# Altium project LimeSDR-PCIe_1v2.PrjPcb (part 5 of 6)

## Sheet 15_Clocks_2.SchDoc: Clocks 2
size A4; Organization: Lime Microsystems; Address1: Surrey Tech Centre; Address2: Guildford GU2 7YG; Address3: Surrey; Address4: United Kingdom; Revision: v1.2; SheetNumber: 15; SheetTotal: 16
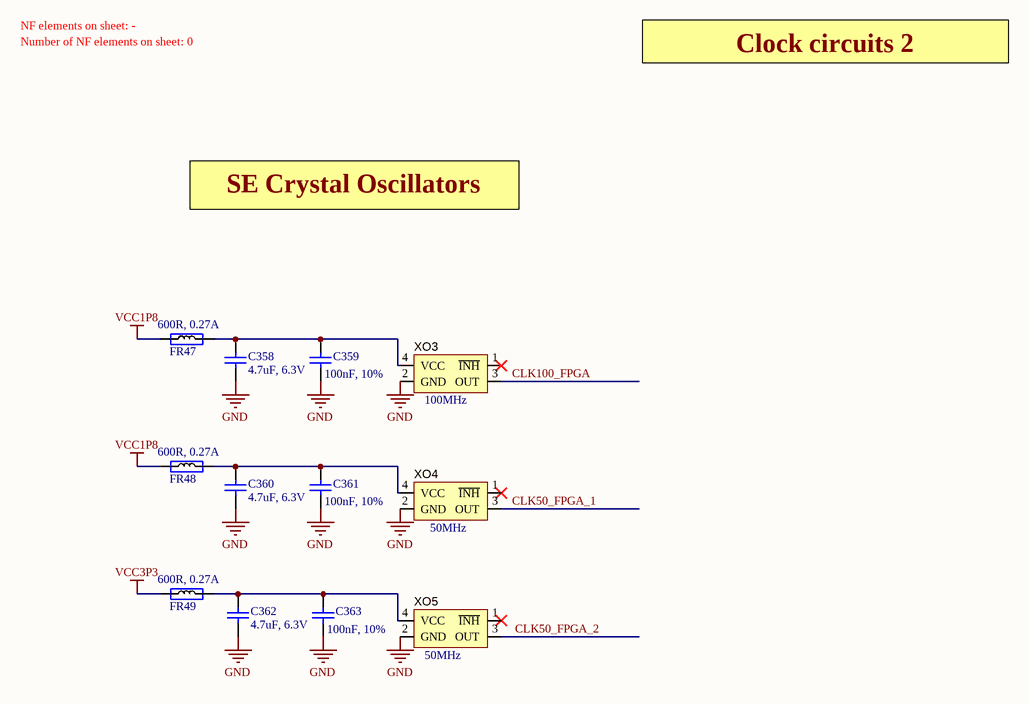
[diagram p15: 15_Clocks_2.SchDoc]

### Parts
C358  4.7uF, 6.3V  [CAP0402]
C359  100nF, 10%  [CAP0402]
C360  4.7uF, 6.3V  [CAP0402]
C361  100nF, 10%  [CAP0402]
C362  4.7uF, 6.3V  [CAP0402]
C363  100nF, 10%  [CAP0402]
FR47  600R, 0.27A  [RES0201]
FR48  600R, 0.27A  [RES0201]
FR49  600R, 0.27A  [RES0201]
XO3  value 100MHz  [CRYSTAL_4-LCC_v4]  (hidden comment: CRYSTAL 100MHz)
XO4  value 50MHz  [CRYSTAL_4-LCC_v4]  (hidden comment: CRYSTAL 50MHz (nr. 1))
XO5  value 50MHz  [CRYSTAL_4-LCC_v4]  (hidden comment: CRYSTAL 50MHz (nr. 2))

### Nets
GND: C358.1 C359.2 C360.1 C361.2 C362.1 C363.2 XO3.2(GND) XO4.2(GND) XO5.2(GND)
VCC1P8: FR47.1 FR48.1
VCC3P3: FR49.1
CLK50_FPGA_1: XO4.3(OUT)
CLK50_FPGA_2: XO5.3(OUT)
CLK100_FPGA: XO3.3(OUT)
NetC358_2: C358.2 C359.1 FR47.2 XO3.4(VCC)
NetC360_2: C360.2 C361.1 FR48.2 XO4.4(VCC)
NetC362_2: C362.2 C363.1 FR49.2 XO5.4(VCC)

Not connected (* = marked no-connect by the designer): XO3 1(~{INH})*; XO4 1(~{INH})*; XO5 1(~{INH})*

### Notes on the sheet
- Number of NF elements on sheet: 0
- NF elements on sheet: -
- Clock circuits 2
- SE Crystal Oscillators
- Project name:
- Title:
- Size:
- Date:
- A4
- Revision:
- Time:
- Sheet
- of
- File:

### Library data of the parts
C358 C360 C362 = Cap_0402: Manufacturer Part Number 1: GRM155R60J475ME87D; Manufacturer: Murata Electronics North America; Part Description: 4.7µF ±20% 6.3V X5R Ceramic Capacitor -55°C ~ 85°C Surface Mount, MLCC 0402 (1005 Metric) 0.039" L x 0.020" W (1.00mm x 0.50mm); Temperature Coefficient: X5R; Capacitance: 4.7µF; Tolerance: ±20%; Value: 4.7uF, 6.3V; Supplier 1: Digi-Key; Supplier Part Number 1: 490-5408-1-ND; Category: Capacitors; Voltage - Rated: 6.3V; Thickness (Max): 0.022" (0.55mm); Applications: General Purpose; Package / Case: 0402 (1005 Metric); Size / Dimension: 0.039" L x 0.020" W (1.00mm x 0.50mm); Features: Derating Recommended; Mounting Type: Surface Mount, MLCC; Ratings: -; Lead Style: -; Operating Temperature: -55°C ~ 85°C; Lead Spacing: -; RoHS: RoHS Compliant; Height - Seated (Max): -; Packaging: Cut Tape (CT)
C359 C361 C363 = Cap_0603: Manufacturer Part Number 1: GRM155R71C104KA88D; Part Description: 0.10µF ±10% 16V X7R Ceramic Capacitor -55°C ~ 125°C Surface Mount, MLCC 0402 (1005 Metric) 0.039" L x 0.020" W (1.00mm x 0.50mm); Brand: Murata Electronics; Type: General Purpose MLCC; Capacitance: 0.1 uF; Temperature Coefficient / Code: +/- 15 %; Voltage Rating DC: 16 V; Supplier 1: Mouser; Supplier Part Number 1: 81-GRM155R71C104KA88; Tolerance: 10 %; Case Code - in: 0402; Manufacturer: Murata Electronics; Category: Multilayer Ceramic Capacitors MLCC - SMD/SMT; Value: 100nF, 10%; Manufacturer Part Number: GRM155R71C104KA88D; Maximum Operating Temperature: + 125 C; Minimum Operating Temperature: - 55 C; Minimum Order Quantity: 1; Operating Temperature Range: - 55 C to + 125 C; Package / Case: 0402 (1005 metric); Packaging: Reel; Product: General Type MLCCs; Product Category: Low & Medium Capacitance SMD Ceramic Chip Capacitors; Reeling: True; RoHS - Mouser: Y; RoHS: RoHS Compliant; Series: GRM; Standard Pack Qty: 10000; Termination Style: SMD/SMT
FR47-FR49 = Ferrite: Manufacturer Part Number 1: BK0603TS601-T; Manufacturer: Taiyo Yuden; Part Description: FERRITE BEAD 600 OHM 0201 1LN; DC Resistance (DCR): 750 mOhm Max; Filter Type: Differential Mode - Single; Impedance @ Frequency: 600 Ohm @ 100MHz; Current Rating: 270mA; Supplier 1: Digi-Key; Supplier Part Number 1: 587-3277-1-ND; Size / Dimension: 0.024" L x 0.012" W (0.60mm x 0.30mm); Package / Case: 0201 (0603 Metric); Height (Max): 0.013" (0.33mm); Mounting Type: Surface Mount; Packaging: Cut Tape (CT); RoHS: RoHS Compliant; Category: Filters; Value: 600R, 0.27A
XO3 = CRYSTAL: Oscillator Crystal; Manufacturer Part Number: KC5032A100.000C1GE00; Manufacturer: AVX Corp/Kyocera Corp; Part Description: OSC XO 100.000MHZ CMOS SMD; Current - Supply (Max): 19mA; Current - Supply (Disable) (Max): 10µA; Voltage - Supply: 1.8V, 2.5V, 3.3V; Function: Standby (Power Down); Output: CMOS; Frequency Stability: ±50ppm; Package / Case: 4-SMD, No Lead (DFN, LCC); Mounting Type: Surface Mount; Ratings: -; RoHS: RoHS Compliant; Height: 0.039" (1.00mm); Category: Crystals and Oscillators; Supplier Part Number 1: 1253-1302-1-ND; Supplier 1: Digi-Key; Size / Dimension: 0.197" L x 0.126" W (5.00mm x 3.20mm); Packaging: Cut Tape (CT); Frequency: 100MHz; Operating Temperature: -40°C ~ 85°C; Type: XO (Standard)
XO4 XO5 = CRYSTAL: Oscillator Crystal; Manufacturer Part Number: KC5032A50.0000CMGE00; Manufacturer: AVX Corp/Kyocera Corp; Part Description: OSCILLATOR XO 50.000MHZ CMOS SMD; Current - Supply (Disable) (Max): 10µA; Frequency Stability: ±50ppm; Voltage - Supply: 1.8V, 2.5V, 3.3V, 5V; Output: CMOS; Current - Supply (Max): 9.5mA; Function: Standby (Power Down); Package / Case: 4-SMD, No Lead (DFN, LCC); Height: 0.039" (1.00mm); Supplier Part Number 1: 1253-1297-1-ND; Supplier 1: Digi-Key; Packaging: Cut Tape (CT); Category: Crystals and Oscillators; Mounting Type: Surface Mount; RoHS: RoHS Compliant; Frequency: 50MHz; Ratings: -; Type: XO (Standard); Size / Dimension: 0.197" L x 0.126" W (5.00mm x 3.20mm); Operating Temperature: -40°C ~ 85°C

## Sheet 16_BoardPowerSupply.SchDoc: Board power supply
size A3; Organization: Lime Microsystems; Address1: Surrey Tech Centre; Address2: Guildford GU2 7YG; Address3: Surrey; Address4: United Kingdom; Revision: v1.2; SheetNumber: 16; SheetTotal: 16
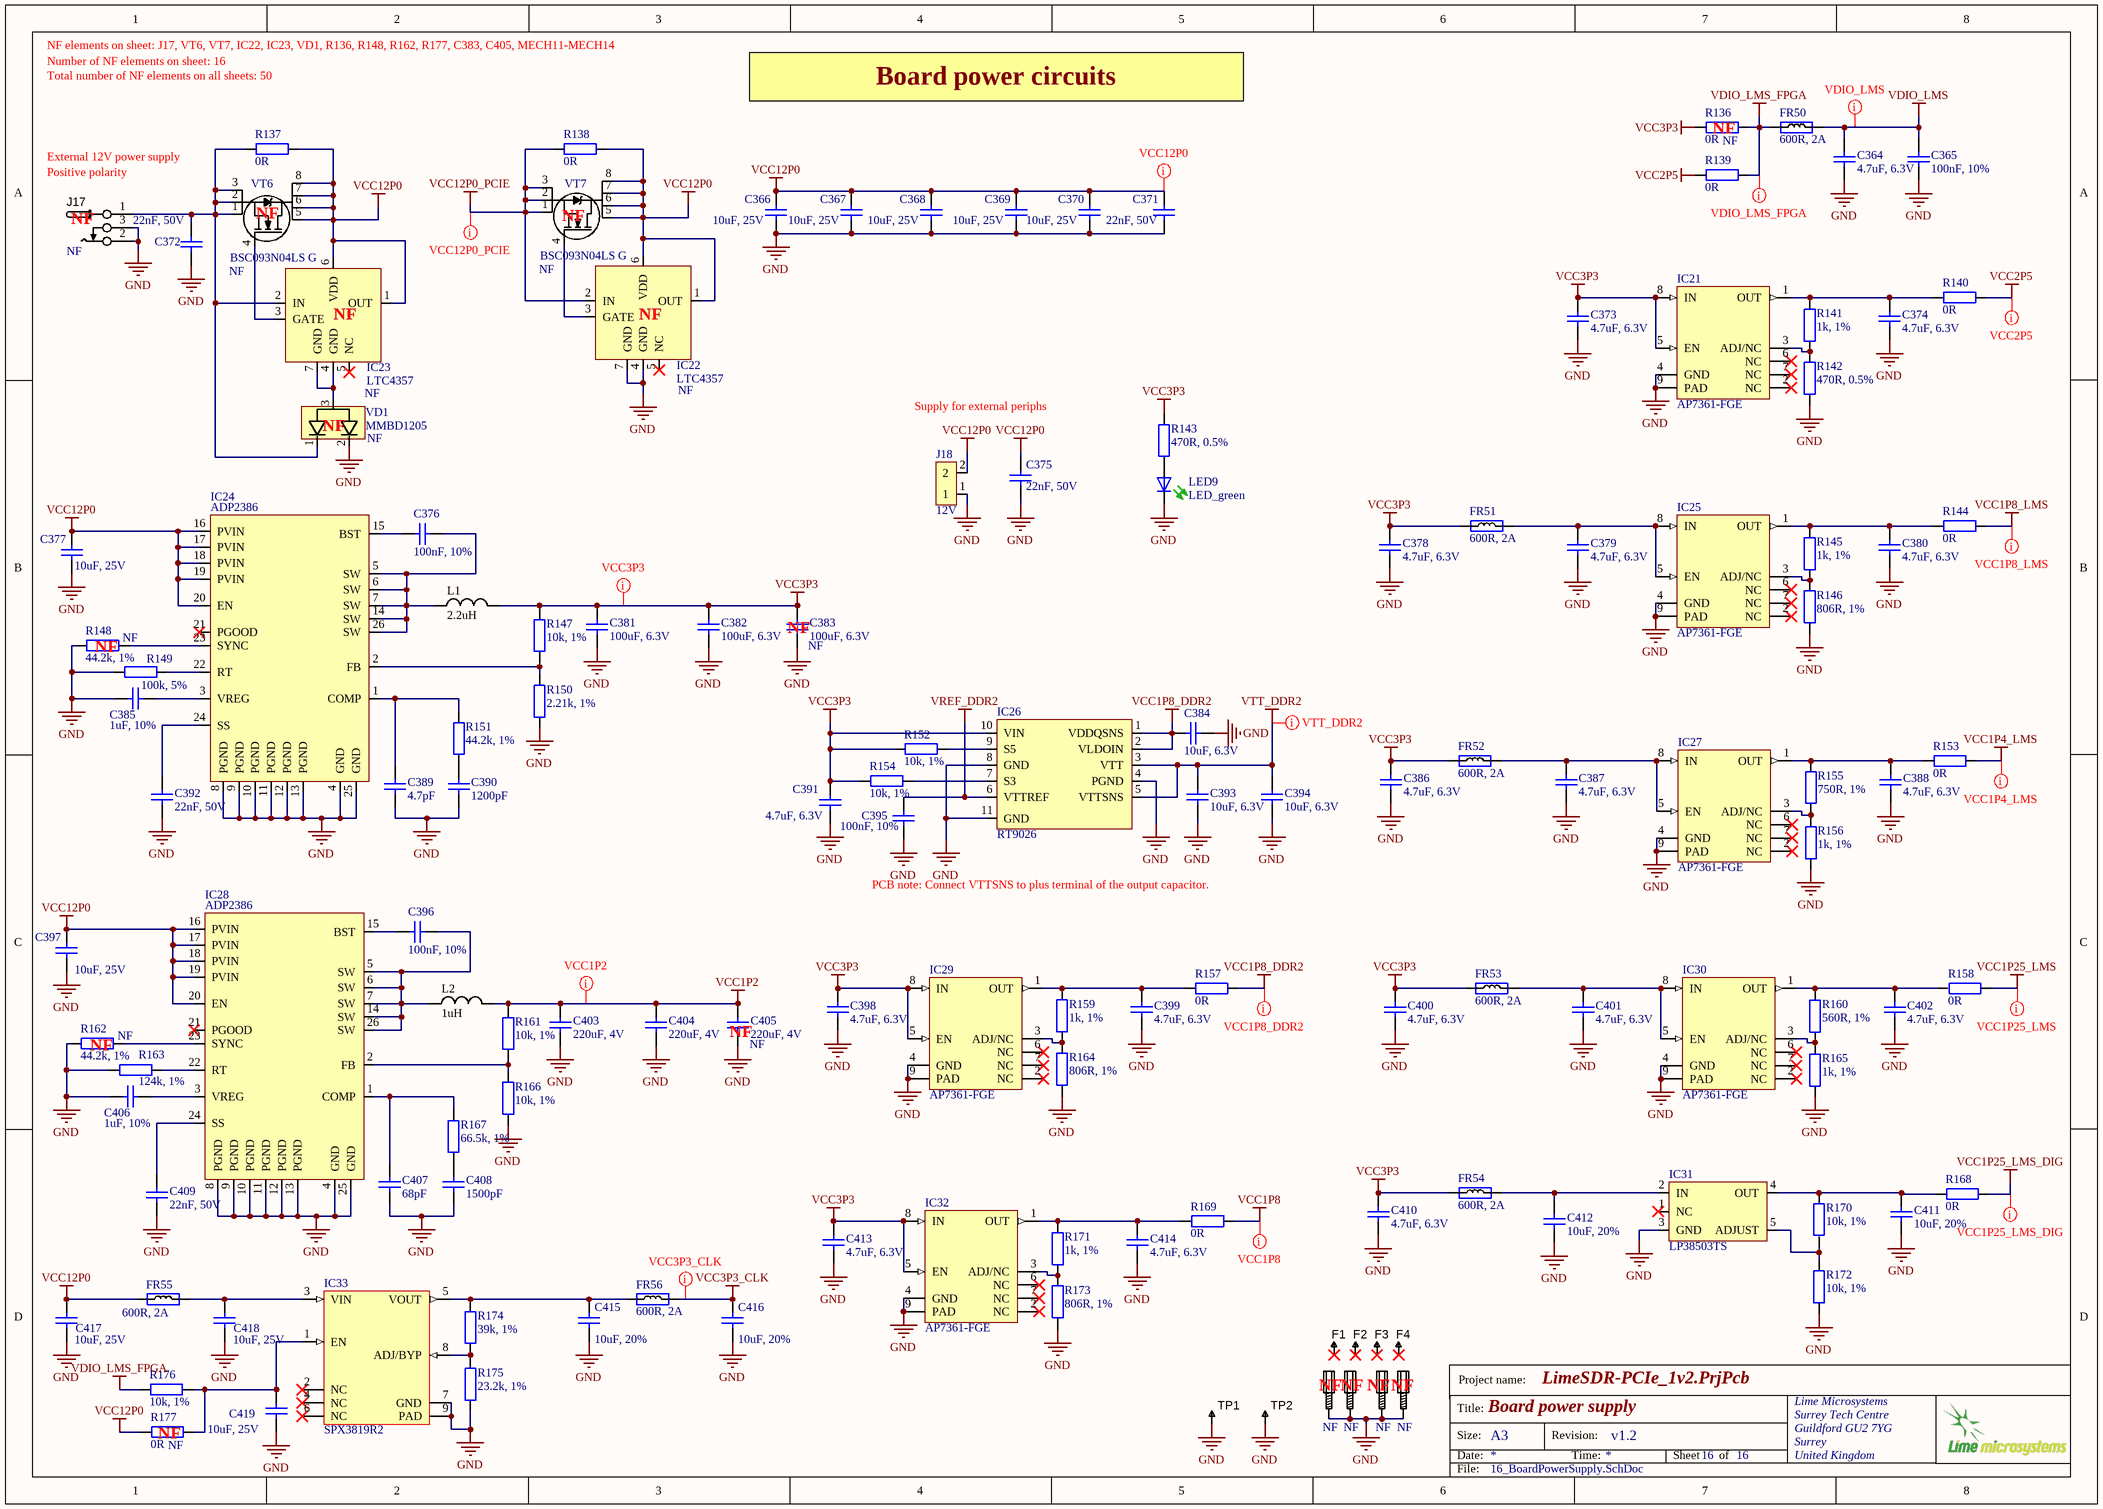
[diagram p16: 16_BoardPowerSupply.SchDoc]

### Parts
C364  4.7uF, 6.3V  [CAP0402]
C365  100nF, 10%  [CAP0402]
C366  10uF, 25V  [CAP0603]
C367  10uF, 25V  [CAP0603]
C368  10uF, 25V  [CAP0603]
C369  10uF, 25V  [CAP0603]
C370  10uF, 25V  [CAP0603]
C371  22nF, 50V  [CAP0402]
C372  22nF, 50V  [CAP0402]
C373  4.7uF, 6.3V  [CAP0402]
C374  4.7uF, 6.3V  [CAP0402]
C375  22nF, 50V  [CAP0402]
C376  100nF, 10%  [CAP0402]
C377  10uF, 25V  [CAP0603]
C378  4.7uF, 6.3V  [CAP0402]
C379  4.7uF, 6.3V  [CAP0402]
C380  4.7uF, 6.3V  [CAP0402]
C381  100uF, 6.3V  [CAP1206]
C382  100uF, 6.3V  [CAP1206]
C383  100uF, 6.3V  Assembly Info: NF  [CAP1206]
C384  10uF, 6.3V  [CAP0603]
C385  1uF, 10%  [CAP0402]
C386  4.7uF, 6.3V  [CAP0402]
C387  4.7uF, 6.3V  [CAP0402]
C388  4.7uF, 6.3V  [CAP0402]
C389  4.7pF  [CAP0402]
C390  1200pF  [CAP0402]
C391  4.7uF, 6.3V  [CAP0402]
C392  22nF, 50V  [CAP0402]
C393  10uF, 6.3V  [CAP0603]
C394  10uF, 6.3V  [CAP0603]
C395  100nF, 10%  [CAP0402]
C396  100nF, 10%  [CAP0402]
C397  10uF, 25V  [CAP0603]
C398  4.7uF, 6.3V  [CAP0402]
C399  4.7uF, 6.3V  [CAP0402]
C400  4.7uF, 6.3V  [CAP0402]
C401  4.7uF, 6.3V  [CAP0402]
C402  4.7uF, 6.3V  [CAP0402]
C403  220uF, 4V  [CAP1206]
C404  220uF, 4V  [CAP1206]
C405  220uF, 4V  Assembly Info: NF  [CAP1206]
C406  1uF, 10%  [CAP0402]
C407  68pF  [CAP0402]
C408  1500pF  [CAP0402]
C409  22nF, 50V  [CAP0402]
C410  4.7uF, 6.3V  [CAP0402]
C411  10uF, 20%  [CAP0603]
C412  10uF, 20%  [CAP0603]
C413  4.7uF, 6.3V  [CAP0402]
C414  4.7uF, 6.3V  [CAP0402]
C415  10uF, 20%  [CAP0603]
C416  10uF, 20%  [CAP0603]
C417  10uF, 25V  [CAP0603]
C418  10uF, 25V  [CAP0603]
C419  10uF, 25V  [CAP0603]
F1  Fiducial  [Fiducial]  (value not drawn)
F2  Fiducial  [Fiducial]  (value not drawn)
F3  Fiducial  [Fiducial]  (value not drawn)
F4  Fiducial  [Fiducial]  (value not drawn)
FR50  600R, 2A  [RES0805]
FR51  600R, 2A  [RES0805]
FR52  600R, 2A  [RES0805]
FR53  600R, 2A  [RES0805]
FR54  600R, 2A  [RES0805]
FR55  600R, 2A  [RES0805]
FR56  600R, 2A  [RES0805]
IC21  AP7361-FGE  [AP7361]
IC22  LTC4357  Assembly Info: NF  [LTC4357]
IC23  LTC4357  Assembly Info: NF  [LTC4357]
IC24  ADP2386  [ADP2386]
IC25  AP7361-FGE  [AP7361]
IC26  RT9026  [MSOP10]
IC27  AP7361-FGE  [AP7361]
IC28  ADP2386  [ADP2386]
IC29  AP7361-FGE  [AP7361]
IC30  AP7361-FGE  [AP7361]
IC31  LP38503TS  [TO-263-5_v2]
IC32  AP7361-FGE  [AP7361]
IC33  SPX3819R2  [SPX3819R2-L/TR]
J17  Assembly Info: NF  [CONN_PWR_JACK_v2]  (hidden comment: CONN_PWR_JACK_2.1x5.5mm)
J18  12V  [HDR_1x2]
L1  2.2uH  [FDVE1040_TOKO_INDUCTOR]
L2  1uH  [FDVE1040_TOKO_INDUCTOR]
LED9  LED_green  [LED-0603-GREEN]
MECH11  Assembly Info: NF  [PCB_standoff]  (hidden comment: # pcs.)
MECH12  Assembly Info: NF  [PCB_standoff]  (hidden comment: # pcs.)
MECH13  Assembly Info: NF  [PCB_standoff]  (hidden comment: # pcs.)
MECH14  Assembly Info: NF  [PCB_standoff]  (hidden comment: # pcs.)
R136  0R  Assembly Info: NF  [RES0402]
R137  0R  [RES0805]
R138  0R  [RES0805]
R139  0R  [RES0402]
R140  0R  [RES0402]
R141  1k, 1%  [RES0402]
R142  470R, 0.5%  [RES0402]
R143  470R, 0.5%  [RES0402]
R144  0R  [RES0402]
R145  1k, 1%  [RES0402]
R146  806R, 1%  [RES0402]
R147  10k, 1%  [RES0402]
R148  44.2k, 1%  Assembly Info: NF  [RES0402]
R149  100k, 5%  [RES0402]
R150  2.21k, 1%  [RES0402]
R151  44.2k, 1%  [RES0402]
R152  10k, 1%  [RES0402]
R153  0R  [RES0402]
R154  10k, 1%  [RES0402]
R155  750R, 1%  [RES0402]
R156  1k, 1%  [RES0402]
R157  0R  [RES0402]
R158  0R  [RES0402]
R159  1k, 1%  [RES0402]
R160  560R, 1%  [RES0402]
R161  10k, 1%  [RES0402]
R162  44.2k, 1%  Assembly Info: NF  [RES0402]
R163  124k, 1%  [RES0402]
R164  806R, 1%  [RES0402]
R165  1k, 1%  [RES0402]
R166  10k, 1%  [RES0402]
R167  66.5k, 1%  [RES0402]
R168  0R  [RES0402]
R169  0R  [RES0402]
R170  10k, 1%  [RES0402]
R171  1k, 1%  [RES0402]
R172  10k, 1%  [RES0402]
R173  806R, 1%  [RES0402]
R174  39k, 1%  [RES0402]
R175  23.2k, 1%  [RES0402]
R176  10k, 1%  [RES0402]
R177  0R  Assembly Info: NF  [RES0402]
TP1  TESTPOINT_THT_MINI  [TP-THT-MIDI]  (value not drawn)
TP2  TESTPOINT_THT_MINI  [TP-THT-MIDI]  (value not drawn)
VD1  MMBD1205  Assembly Info: NF  [SOT23-3_v2]
VT6  BSC093N04LS G  Assembly Info: NF  [BSC093N04LS_G]
VT7  BSC093N04LS G  Assembly Info: NF  [BSC093N04LS_G]

### Nets
GND: C364.1 C365.2 C366.1 C367.1 C368.1 C369.1 C370.1 C371.2 C372.2 C373.1 C374.1 C375.2 C377.1 C378.1 C379.1 C380.1 C381.1 C382.1 C383.1 C384.1 C385.2 C386.1 C387.1 C388.1 C389.2 C390.2 C391.1 C392.2 C393.1 C394.1 C395.2 C397.1 C398.1 C399.1 C400.1 C401.1 C402.1 C403.1 C404.1 C405.1 C406.2 C407.2 C408.2 C409.2 C410.1 C411.1 C412.1 C413.1 C414.1 C415.1 C416.1 C417.1 C418.1 C419.1 IC21.4(GND) IC21.9(PAD) IC22.4(GND) IC22.7(GND) IC24.4(GND) IC24.8(PGND) IC24.9(PGND) IC24.10(PGND) IC24.11(PGND) IC24.12(PGND) IC24.13(PGND) IC24.25(GND) IC25.4(GND) IC25.9(PAD) IC26.4(PGND) IC26.8(GND) IC26.11(GND) IC27.4(GND) IC27.9(PAD) IC28.4(GND) IC28.8(PGND) IC28.9(PGND) IC28.10(PGND) IC28.11(PGND) IC28.12(PGND) IC28.13(PGND) IC28.25(GND) IC29.4(GND) IC29.9(PAD) IC30.4(GND) IC30.9(PAD) IC31.3(GND) IC32.4(GND) IC32.9(PAD) IC33.7(GND) IC33.9(PAD) J17.2 J17.3 J18.1 LED9.K(C) MECH11.MH1 MECH12.MH1 MECH13.MH1 MECH14.MH1 R142.2 R146.2 R148.1 R149.2 R150.1 R156.1 R162.1 R163.2 R164.2 R165.1 R166.2 R172.2 R173.2 R175.1 TP1.1 TP2.1 VD1.2
VCC1P2: C403.2 C404.2 C405.2 L2.2 R161.1
VCC1P4_LMS: R153.1
VCC1P8: R169.1
VCC1P8_DDR2: C384.2 IC26.1(VDDQSNS) IC26.2(VLDOIN) R157.1
VCC1P8_LMS: R144.1
VCC1P25_LMS: R158.1
VCC1P25_LMS_DIG: R168.1
VCC2P5: R139.2 R140.1
VCC3P3: C373.2 C378.2 C381.2 C382.2 C383.2 C386.2 C391.2 C398.2 C400.2 C410.2 C413.2 FR51.1 FR52.1 FR53.1 FR54.1 IC21.5(EN) IC21.8(IN) IC26.10(VIN) IC29.5(EN) IC29.8(IN) IC32.5(EN) IC32.8(IN) L1.2 R136.2 R143.2 R147.1 R152.1 R154.1
VCC3P3_CLK: C416.2 FR56.2
VCC12P0: C366.2 C367.2 C368.2 C369.2 C370.2 C371.1 C375.1 C377.2 C397.2 C417.2 FR55.1 IC22.1(OUT) IC22.6(VDD) IC23.1(OUT) IC23.6(VDD) IC24.16(PVIN) IC24.17(PVIN) IC24.18(PVIN) IC24.19(PVIN) IC24.20(EN) IC28.16(PVIN) IC28.17(PVIN) IC28.18(PVIN) IC28.19(PVIN) IC28.20(EN) J18.2 R137.1 R138.1 R177.2 VT6.5(D) VT6.6(D) VT6.7(D) VT6.8(D) VT7.5(D) VT7.6(D) VT7.7(D) VT7.8(D)
VCC12P0_PCIE: IC22.2(IN) R138.2 VT7.1(S) VT7.2(S) VT7.3(S)
VDIO_LMS: C364.2 C365.1 FR50.2
VDIO_LMS_FPGA: FR50.1 R136.1 R139.1 R176.1
VREF_DDR2: C395.1 IC26.6(VTTREF)
VTT_DDR2: C393.2 C394.2 IC26.3(VTT) IC26.5(VTTSNS)
NetC372_1: C372.1 IC23.2(IN) J17.1 R137.2 VD1.1 VT6.1(S) VT6.2(S) VT6.3(S)
NetC374_2: C374.2 IC21.1(OUT) R140.2 R141.2
NetC376_1: C376.1 IC24.15(BST)
NetC376_2: C376.2 IC24.5(SW) IC24.6(SW) IC24.7(SW) IC24.14(SW) IC24.26(SW) L1.1
NetC379_2: C379.2 FR51.2 IC25.5(EN) IC25.8(IN)
NetC380_2: C380.2 IC25.1(OUT) R144.2 R145.2
NetC385_1: C385.1 IC24.3(VREG)
NetC387_2: C387.2 FR52.2 IC27.5(EN) IC27.8(IN)
NetC388_2: C388.2 IC27.1(OUT) R153.2 R155.1
NetC389_1: C389.1 IC24.1(COMP) R151.2
NetC390_1: C390.1 R151.1
NetC392_1: C392.1 IC24.24(SS)
NetC396_1: C396.1 IC28.15(BST)
NetC396_2: C396.2 IC28.5(SW) IC28.6(SW) IC28.7(SW) IC28.14(SW) IC28.26(SW) L2.1
NetC399_2: C399.2 IC29.1(OUT) R157.2 R159.2
NetC401_2: C401.2 FR53.2 IC30.5(EN) IC30.8(IN)
NetC402_2: C402.2 IC30.1(OUT) R158.2 R160.2
NetC406_1: C406.1 IC28.3(VREG)
NetC407_1: C407.1 IC28.1(COMP) R167.2
NetC408_1: C408.1 R167.1
NetC409_1: C409.1 IC28.24(SS)
NetC411_2: C411.2 IC31.4(OUT) R168.2 R170.1
NetC412_2: C412.2 FR54.2 IC31.2(IN)
NetC414_2: C414.2 IC32.1(OUT) R169.2 R171.2
NetC415_2: C415.2 FR56.1 IC33.5(VOUT) R174.1
NetC418_2: C418.2 FR55.2 IC33.3(VIN)
NetC419_2: C419.2 IC33.1(EN) R176.2 R177.1
NetIC21_3: IC21.3(ADJ/NC) R141.1 R142.1
NetIC22_3: IC22.3(GATE) VT7.4(G)
NetIC23_3: IC23.3(GATE) VT6.4(G)
NetIC23_4: IC23.4(GND) IC23.7(GND) VD1.3
NetIC24_2: IC24.2(FB) R147.2 R150.2
NetIC24_22: IC24.22(RT) R149.1
NetIC24_23: IC24.23(SYNC) R148.2
NetIC25_3: IC25.3(ADJ/NC) R145.1 R146.1
NetIC26_7: IC26.7(S3) R154.2
NetIC26_9: IC26.9(S5) R152.2
NetIC27_3: IC27.3(ADJ/NC) R155.2 R156.2
NetIC28_2: IC28.2(FB) R161.2 R166.1
NetIC28_22: IC28.22(RT) R163.1
NetIC28_23: IC28.23(SYNC) R162.2
NetIC29_3: IC29.3(ADJ/NC) R159.1 R164.1
NetIC30_3: IC30.3(ADJ/NC) R160.1 R165.2
NetIC31_5: IC31.5(ADJUST) R170.2 R172.1
NetIC32_3: IC32.3(ADJ/NC) R171.1 R173.1
NetIC33_8: IC33.8(ADJ/BYP) R174.2 R175.2
NetLED9_A: LED9.A R143.1

Not connected (* = marked no-connect by the designer): F1 1*; F2 1*; F3 1*; F4 1*; IC21 2(NC)* 6(NC)* 7(NC)*; IC22 5(NC)*; IC23 5(NC)*; IC24 21(PGOOD)*; IC25 2(NC)* 6(NC)* 7(NC)*; IC27 2(NC)* 6(NC)* 7(NC)*; IC28 21(PGOOD)*; IC29 2(NC)* 6(NC)* 7(NC)*; IC30 2(NC)* 6(NC)* 7(NC)*; IC31 1(NC)*; IC32 2(NC)* 6(NC)* 7(NC)*; IC33 2(NC)* 4(NC)* 6(NC)*

### Layout directives
net class VDIO_LMS: VDIO_LMS
net class VDIO_LMS_FPGA: VDIO_LMS_FPGA
net class VCC2P5: VCC2P5
net class VCC1P8_LMS: VCC1P8_LMS
net class VCC1P4_LMS: VCC1P4_LMS
net class VCC1P25_LMS: VCC1P25_LMS
net class VCC1P25_LMS_DIG: VCC1P25_LMS_DIG
net class VCC1P8_DDR2: VCC1P8_DDR2
net class VCC1P8: VCC1P8
net class VCC1P2: VCC1P2
net class VCC3P3: VCC3P3
net class VTT_DDR2: VTT_DDR2
net class VCC12P0: VCC12P0
net class VCC12P0_PCIE: VCC12P0_PCIE
net class VCC3P3_CLK: VCC3P3_CLK

### Notes on the sheet
- Number of NF elements on sheet: 16
- Total number of NF elements on all sheets: 50
- NF elements on sheet: J17, VT6, VT7, IC22, IC23, VD1, R136, R148, R162, R177, C383, C405, MECH11-MECH14
- Board power circuits
- (near J17) Positive polarity
- External 12V power supply
- (near R136) NF
- (near J17) NF
- (near VT6) NF
- (near VT7) NF
- (near IC23) NF
- (near IC22) NF
- (near VD1) NF
- Supply for external periphs
- (near R148) NF
- (near C383) NF
- PCB note: Connect VTTSNS to plus terminal of the output capacitor.
- (near R162) NF
- (near C405) NF
- NF
- (near R177) NF
- Project name:
- Title:
- Size:
- Date:
- A3
- Revision:
- Time:
- Sheet
- of
- File:

### Library data of the parts
C364 C373 C374 C378-C380 C386-C388 C391 C398-C402 C410 C413 C414 = Cap_0402: as C358 on sheet 15_Clocks_2; Value: 4.7uF, 6.3V; Supplier 1: Digi-Key; Supplier Part Number 1: 490-5408-1-ND; Category: Capacitors; Voltage - Rated: 6.3V; Thickness (Max): 0.022" (0.55mm); Applications: General Purpose; Package / Case: 0402 (1005 Metric); Size / Dimension: 0.039" L x 0.020" W (1.00mm x 0.50mm); Features: Derating Recommended; Mounting Type: Surface Mount, MLCC; Ratings: -; Lead Style: -; Operating Temperature: -55°C ~ 85°C; Lead Spacing: -; RoHS: RoHS Compliant; Height - Seated (Max): -; Packaging: Cut Tape (CT)
C365 C395 = Cap_0402: as C312-C314 on sheet 14_Clocks_1; Value: 100nF, 10%; Supplier 1: Mouser; Supplier Part Number 1: 81-GRM155R71C104KA88; Case Code - in: 0402; RoHS: RoHS Compliant; Operating Temperature Range: - 55 C to + 125 C; Series: GRM; Termination Style: SMD/SMT; Tolerance: 10 %; Package / Case: 0402 (1005 metric); Maximum Operating Temperature: + 125 C; Case Code - mm: 1005; Minimum Operating Temperature: - 55 C; Product Category: Low & Medium Capacitance SMD Ceramic Chip Capacitors; Packaging: Reel; Product: General Type MLCCs; Category: Multilayer Ceramic Capacitors MLCC - SMD/SMT; Brand: Murata Electronics; Case Width: 0.5 mm; RoHS - Mouser: Y; Standard Pack Qty: 10000; Minimum Order Quantity: 1; Reeling: True; Manufacturer Part Number 1: GRM155R71C104KA88D
C366-C370 C377 C397 C417-C419 = Cap_0603: Manufacturer: Murata Electronics North America; Manufacturer Part Number: GRM188R61E106MA73D; Part Description: 10µF ±20% 25V X5R Ceramic Capacitor -55°C ~ 85°C Surface Mount, MLCC 0603 (1608 Metric) 0.063" L x 0.031" W (1.60mm x 0.80mm); Capacitance: 10µF; Tolerance: ±20%; Temperature Coefficient: X5R; Supplier 1: Digi-Key; Supplier Part Number 1: 490-7202-2-ND; Category: Capacitors; RoHS: RoHS Compliant; Packaging: Tape & Reel (TR); Voltage - Rated: 25V; Mounting Type: Surface Mount, MLCC; Operating Temperature: -55°C ~ 85°C; Applications: General Purpose; Ratings: -; Package / Case: 0603 (1608 Metric); Size / Dimension: 0.063" L x 0.031" W (1.60mm x 0.80mm); Height - Seated (Max): -; Thickness (Max): 0.031" (0.80mm); Lead Spacing: -; Features: -; Lead Style: -; value: 10uF, 25V
C371 C372 C375 C392 C409 = Cap_0402: Manufacturer: Kemet; Manufacturer Part Number 1: C0402C223K5RACTU; Part Description: 0.022µF ±10% 50V X7R Ceramic Capacitor -55°C ~ 125°C Surface Mount, MLCC 0402 (1005 Metric) 0.039" L x 0.020" W (1.00mm x 0.50mm); Temperature Coefficient: X7R; Tolerance: ±10%; Capacitance: 0.022µF; Value: 22nF, 50V; Supplier 1: Digi-Key; Supplier Part Number 1: 399-7780-1-ND; Ratings: -; Packaging: Cut Tape (CT); Category: Capacitors; Size / Dimension: 0.039" L x 0.020" W (1.00mm x 0.50mm); RoHS: RoHS Compliant; Operating Temperature: -55°C ~ 125°C; Mounting Type: Surface Mount, MLCC; Applications: General Purpose; Voltage - Rated: 50V; Thickness (Max): 0.022" (0.55mm); Features: -; Height - Seated (Max): -; Lead Style: -; Package / Case: 0402 (1005 Metric); Lead Spacing: -
C376 C396 = Cap_0402: Manufacturer: Murata Electronics; Manufacturer Part Number 1: GRM155R71C104KA88D; Part Description: 0.10µF ±10% 16V X7R Ceramic Capacitor -55°C ~ 125°C Surface Mount, MLCC 0402 (1005 Metric) 0.039" L x 0.020" W (1.00mm x 0.50mm); Voltage Rating DC: 16 V; Type: General Purpose MLCC; Capacitance: 0.1 uF; Case Length: 1 mm; Dielectric: X7R; Case Height: 0.5 mm; Temperature Coefficient / Code: +/- 15 %; Value: 100nF, 10%; Supplier 1: Mouser; Supplier Part Number 1: 81-GRM155R71C104KA88; Case Code - in: 0402; RoHS: RoHS Compliant; Operating Temperature Range: - 55 C to + 125 C; Series: GRM; Termination Style: SMD/SMT; Tolerance: 10 %; Package / Case: 0402 (1005 metric); Maximum Operating Temperature: + 125 C; Case Code - mm: 1005; Minimum Operating Temperature: - 55 C; Product Category: Low & Medium Capacitance SMD Ceramic Chip Capacitors; Packaging: Reel; Product: General Type MLCCs; Category: Multilayer Ceramic Capacitors MLCC - SMD/SMT; Brand: Murata Electronics; Case Width: 0.5 mm; RoHS - Mouser: Y; Standard Pack Qty: 10000; Minimum Order Quantity: 1; Reeling: True; Manufacturer Part Number: GRM155R71C104KA88D
C381-C383 = Cap_1206: Manufacturer: MURATA; Manufacturer Part Number 1: GRM31CR60J107ME39L.; Part Description: SMD Multilayer Ceramic Capacitor, GRM Series, 100 µF, ± 20%, X5R, 6.3 V, 1206 [3216 Metric]; Capacitance Tolerance: ± 20%; Ceramic Capacitor Case: 1206 [3216 Metric]; Voltage Rating: 6.3; value: 100uF, 6.3V; Supplier Part Number 1: 1735535; Supplier 1: Farnell
C384 C393 C394 = Cap_0603: Manufacturer Part Number 1: CC0603MRX5R5BB106; Part Description: 10µF ±20% 6.3V X5R Ceramic Capacitor -55°C ~ 85°C Surface Mount, MLCC 0603 (1608 Metric) 0.063" L x 0.031" W (1.60mm x 0.80mm); Manufacturer: Yageo; Capacitance: 10µF; Tolerance: ±20%; Supplier 1: Digi-Key; Supplier Part Number 1: 311-1448-2-ND; Package / Case: 0603 (1608 Metric); Category: Capacitors; Voltage - Rated: 6.3V; Value: 10uF, 6.3V
C385 C406 = Cap_0402: Manufacturer Part Number 1: GRM155R61A105KE15J; Manufacturer: TDK; Part Description: 1µF ±10% 10V X5R Ceramic Capacitor -55°C ~ 85°C Surface Mount, MLCC 0402 (1005 Metric) 0.039" L x 0.020" W (1.00mm x 0.50mm); Voltage Rating: 10; Product Range: TDK - C Series; Ceramic Capacitor Case: 0402 [1005 Metric]; Capacitance: 1; Dielectric Characteristic: X6; Value: 1uF, 10%; Supplier 1: Newark; Supplier Part Number 1: 490-6298-2-ND; Capacitance Tolerance: ± 10%; MSL: -; RoHS: YES
C389 = Cap_0402: Manufacturer: MURATA; Manufacturer Part Number 1: GRM1555C1H4R7CA01D; Part Description: 4.7pF ±0.25pF 50V C0G, NP0 Ceramic Capacitor -55°C ~ 125°C Surface Mount, MLCC 0402 (1005 Metric) 0.039" L x 0.020" W (1.00mm x 0.50mm); Capacitance Tolerance: ± 0.25; Voltage Rating: 50; Dielectric Characteristic: C0G / NP0; Ceramic Capacitor Case: 0402 [1005 Metric]; Capacitance: 4.7; SVHC: No SVHC (15-Jun-2015; Product Range: GRM Series; Value: 4.7pF; Supplier 1: Farnell; Supplier Part Number 1: 2434644; Operating Temperature Max: 125; Operating Temperature Min: -55; MSL: MSL 1 - Unlimited; RoHS: YES; Packaging: Cut Tape
C390 = Cap_0402: Manufacturer: Kemet; Manufacturer Part Number 1: C0402C122J5GACTU; Part Description: 1200pF ±5% 50V C0G, NP0 Ceramic Capacitor -55°C ~ 125°C Surface Mount, MLCC 0402 (1005 Metric) 0.039" L x 0.020" W (1.00mm x 0.50mm); Temperature Coefficient: C0G, NP0; Tolerance: ±5%; Voltage - Rated: 50V; Value: 1200pF; Supplier 1: Digi-Key; Supplier Part Number 1: 399-7334-1-ND; Thickness (Max): 0.022" (0.55mm); Capacitance: 1200pF; Lead Spacing: -; Mounting Type: Surface Mount, MLCC; Package / Case: 0402 (1005 Metric); Category: Capacitors; Size / Dimension: 0.039" L x 0.020" W (1.00mm x 0.50mm); Lead Style: -; Ratings: -; Features: -; Packaging: Cut Tape (CT); RoHS: RoHS Compliant; Operating Temperature: -55°C ~ 125°C; Applications: General Purpose; Height - Seated (Max): -
C403-C405 = Cap_1206: Manufacturer Part Number: GRM31CR60G227ME11L; Manufacturer: Murata Electronics North America; Part Description: 220µF ±20% 4V X5R Ceramic Capacitor -55°C ~ 85°C Surface Mount, MLCC 1206 (3216 Metric) 0.126" L x 0.063" W (3.20mm x 1.60mm); Capacitance: 220µF; Temperature Coefficient: X5R; Tolerance: ±20%; Package / Case: 1206 (3216 Metric); Supplier 1: Digi-Key; Packaging: Cut Tape (CT); Size / Dimension: 0.126" L x 0.063" W (3.20mm x 1.60mm); Operating Temperature: -55°C ~ 85°C; Voltage - Rated: 4V; Mounting Type: Surface Mount, MLCC; Ratings: -; Supplier Part Number 1: 490-9774-1-ND; Category: Capacitors; Lead Spacing: -; Lead Style: -; Applications: General Purpose; Features: -; Height - Seated (Max): -; Thickness (Max): 0.075" (1.90mm); RoHS: RoHS Compliant; Value: 220uF, 4V
C407 = Cap_0402: Manufacturer Part Number 1: CBR04C680F3GAC; Manufacturer: Kemet; Part Description: 68pF ±1% 25V C0G, NP0 Ceramic Capacitor -55°C ~ 125°C Surface Mount, MLCC 0402 (1005 Metric) 0.039" L x 0.020" W (1.00mm x 0.50mm); Temperature Coefficient: C0G, NP0; Voltage - Rated: 25V; Tolerance: ±1%; Value: 68pF; Supplier 1: Digi-Key; Supplier Part Number 1: 399-11255-1-ND; Applications: RF, Microwave, High Frequency; Capacitance: 68pF; Mounting Type: Surface Mount, MLCC; Package / Case: 0402 (1005 Metric); Features: High Q, Low Loss; Lead Spacing: -; Size / Dimension: 0.039" L x 0.020" W (1.00mm x 0.50mm); Operating Temperature: -55°C ~ 125°C; Packaging: Cut Tape (CT); Thickness (Max): 0.022" (0.55mm); Category: Capacitors; Lead Style: -; Ratings: -; Height - Seated (Max): -; RoHS: RoHS Compliant
C408 = Cap_0402: Manufacturer Part Number 1: CL05B152KB5NNNC; Manufacturer: Samsung Electro-Mechanics America, Inc.; Part Description: 1500pF ±10% 50V X7R Ceramic Capacitor -55°C ~ 125°C Surface Mount, MLCC 0402 (1005 Metric) 0.039" L x 0.020" W (1.00mm x 0.50mm); Temperature Coefficient: X7R; Voltage - Rated: 50V; Tolerance: ±10%; Value: 1500pF; Supplier 1: Digi-Key; Supplier Part Number 1: 1276-1521-1-ND; Thickness (Max): 0.022" (0.55mm); Features: -; Category: Capacitors; Size / Dimension: 0.039" L x 0.020" W (1.00mm x 0.50mm); RoHS: RoHS Compliant; Package / Case: 0402 (1005 Metric); Mounting Type: Surface Mount, MLCC; Packaging: Cut Tape (CT); Lead Style: -; Lead Spacing: -; Capacitance: 1500pF; Applications: General Purpose; Height - Seated (Max): -; Ratings: -; Operating Temperature: -55°C ~ 125°C
C411 C412 C415 C416 = Cap_0603: Manufacturer: Yageo; Manufacturer Part Number 1: GRM188R61C106MA73D; Part Description: 10µF ±20% 16V X5R Ceramic Capacitor -55°C ~ 85°C Surface Mount, MLCC 0603 (1608 Metric) 0.063" L x 0.031" W (1.60mm x 0.80mm); Temperature Coefficient: X5R; Capacitance: 10µF; Voltage - Rated: 16V; Value: 10uF, 20%; Supplier 1: Digi-Key; Supplier Part Number 1: 490-7201-2-ND; Category: Capacitors; Ratings: -; Features: -; Lead Style: -; Package / Case: 0603 (1608 Metric); Lead Spacing: -; Applications: General Purpose; Operating Temperature: -55°C ~ 85°C; Tolerance: ±20%; Thickness (Max): 0.039" (1.00mm); Mounting Type: Surface Mount, MLCC; RoHS: RoHS Compliant; Size / Dimension: 0.063" L x 0.031" W (1.60mm x 0.80mm); Packaging: Tape & Reel (TR); Height - Seated (Max): -
FR50-FR56 = Ferrite: as FR40-FR46 on sheet 14_Clocks_1; Supplier 1: Digi-Key; Supplier Part Number 1: 445-2206-2-ND; Mounting Type: Surface Mount; RoHS: RoHS Compliant; Height (Max): 0.041" (1.05mm); Packaging: Tape & Reel (TR); Category: Filters; Current Rating: 2A; Package / Case: 0805 (2012 Metric); Size / Dimension: 0.079" L x 0.049" W (2.00mm x 1.25mm)
IC21 IC25 IC27 IC29 IC30 IC32 = AP7361: Manufacturer Part Number: AP7361-FGE-7; Manufacturer: Diodes Incorporated; Part Description: IC REG LDO ADJ 1A 8DFN; Regulator Topology: Positive Adjustable; Current - Output: 1A; Current - Limit (Min): 1.1A; Voltage - Dropout (Typical): 0.5V @ 1A; Voltage - Output: 0.8 V ~ 5.5 V; Number of Regulators: 1; Voltage - Input: 2.2 V ~ 6 V; Supplier 1: Digi-Key; Supplier Part Number 1: AP7361-FGE-7DICT-ND; RoHS: RoHS Compliant; Supplier Device Package: U-DFN3030-8; Mounting Type: Surface Mount; Category: Integrated Circuits (ICs); Packaging: Cut Tape (CT); Package / Case: 8-UDFN Exposed Pad; Operating Temperature: -40°C ~ 85°C
IC22 IC23 = LTC4357: Manufacturer Part Number: LTC4357IDCB#TRMPBF; Part Description: IC OR CTRLR N+1 6DFN; Manufacturer: Linear Technology; Current - Supply: 500µA; Delay Time - OFF: 300ns; Voltage - Supply: 9 V ~ 80 V; FET Type: N-Channel; Supplier 1: Digi-Key; Type: N+1 ORing Controller; Category: Integrated Circuits (ICs); Applications: Automotive, Redundant Power Supplies, Telecom Infrastructure; Operating Temperature: -40°C ~ 85°C; Supplier Device Package: 6-DFN (2x3); Supplier Part Number 1: LTC4357IDCB#TRMPBFDKR-ND
IC24 = ADP2386: Manufacturer Part Number: ADP2386ACPZN-R7; Manufacturer: Analog Devices Inc.; Part Description: IC REG BUCK ADJ 6A SYNC 24LFCSP; Function: Step-Down; Voltage - Output (Max): 18V; Synchronous Rectifier: Yes; Output Configuration: Positive; Frequency - Switching: 200kHz ~ 1.4MHz; Number of Outputs: 1; Output Type: Adjustable; Topology: Buck; Voltage - Input (Min): 4.5V; Voltage - Output (Min/Fixed): 0.6V; Voltage - Input (Max): 20V; Current - Output: 6A; Supplier 1: Digi-Key; Packaging: Digi-Reel®; RoHS: RoHS Compliant; Package / Case: 24-WFQFN Exposed Pad, CSP; Operating Temperature: -40°C ~ 125°C (TJ); Supplier Device Package 1: 24-LFCSP-WQ (4x4); Mounting Type: Surface Mount; Category: Integrated Circuits (ICs); Supplier Part Number 1: ADP2386ACPZN-R7DKR-ND
IC26 = RT9026: Manufacturer Part Number 1: RT9026GFP; Manufacturer: Richtek USA Inc.; Part Description: IC DDR TERMINATION REG 10MSOP; Number of Outputs: 1; Voltage - Input: 3.15 V ~ 5.5 V; Supplier 1: Digi-Key; Supplier Part Number 1: 1028-1010-1-ND; Supplier Device Package: 10-MSOP-EP; Operating Temperature: -40°C ~ 85°C; Applications: Converter, DDR Bus Termination Regulator; RoHS: RoHS Compliant; Packaging: Cut Tape (CT); Mounting Type: Surface Mount; Package / Case: 10-TFSOP, 10-MSOP (0.118", 3.00mm Width) Exposed Pad; Category: Integrated Circuits (ICs)
IC28 = ADP2386: Manufacturer Part Number 1: ADP2386ACPZN-R7; Manufacturer: Analog Devices Inc.; Part Description: IC REG BUCK ADJ 6A SYNC 24LFCSP; Function: Step-Down; Voltage - Output (Max): 18V; Synchronous Rectifier: Yes; Output Configuration: Positive; Frequency - Switching: 200kHz ~ 1.4MHz; Number of Outputs: 1; Output Type: Adjustable; Topology: Buck; Voltage - Input (Min): 4.5V; Voltage - Output (Min/Fixed): 0.6V; Voltage - Input (Max): 20V; Current - Output: 6A; Supplier 1: Digi-Key; Packaging: Digi-Reel®; RoHS: RoHS Compliant; Package / Case: 24-WFQFN Exposed Pad, CSP; Operating Temperature: -40°C ~ 125°C (TJ); Supplier Device Package: 24-LFCSP-WQ (4x4); Mounting Type: Surface Mount; Category: Integrated Circuits (ICs); Supplier Part Number 1: ADP2386ACPZN-R7DKR-ND
IC31 = LP38503TS: Manufacturer Part Number: LP38503TS-ADJ/NOPB; Manufacturer: Texas Instruments; Part Description: IC REG LDO ADJ 3A TO263-5; Regulator Topology: Positive Adjustable; Voltage - Dropout (Typical): 0.42V @ 3A; Number of Regulators: 1; Current - Output: 3A; Voltage - Output: 0.6 V ~ 5 V; Voltage - Input: 2.7 V ~ 5.5 V; Supplier 1: Digi-Key; Category: Integrated Circuits (ICs); RoHS: RoHS Compliant By Exemption; Operating Temperature: -40°C ~ 125°C; Packaging: Tube; Current - Limit (Min): -; Package / Case: TO-263-6, D²Pak (5 Leads + Tab), TO-263BA; Mounting Type: Surface Mount; Supplier Device Package: DDPAK/TO-263-5; Supplier Part Number 1: LP38503TS-ADJ/NOPB-ND
IC33 = SPX3819R2-L/TR: Manufacturer: Exar Corporation; Part Description: Linear Voltage Regulator IC Positive Adjustable 1 Output Adjustable 500mA 8-DFN (2x3); Regulator Topology: Positive Adjustable; Voltage - Output: Adjustable; Current - Output: 500mA; Voltage - Dropout (Typical): 0.34V @ 500mA; Number of Regulators: 1; Voltage - Input: 2.5 V ~ 16 V; Supplier 1: Digi-Key; Manufacturer Part Number 1: SPX3819R2-L/TR; RoHS: RoHS Compliant; Category: Integrated Circuits (ICs); Stock 1: 18339; Pricing 1: 1=0.98, 10=0.855, 25=0.7556, 100=0.6586, 250=0.57328, 500=0.48802, 1000=0.39089 (USD); Packaging: Cut Tape (CT); Part Status: Active; Current - Limit (Min): -; Operating Temperature: -40°C ~ 125°C; Mounting Type: Surface Mount; Package / Case: 8-VFDFN Exposed Pad; Supplier Device Package: 8-DFN (2x3); ComponentLink1URL: https://www.exar.com/content/document.ashx?id=615; ComponentLink1Description: https://www.exar.com/content/document.ashx?id=615; Supplier Part Number 1: 1016-1588-1-ND
J17 = CONN_PWR_JACK_2.1x5.5mm: Power Connector, THT, 2.1mm ID, 5.5mm OD; Manufacturer Part Number 1: RAPC712X; Manufacturer: SWITCHCRAFT; Part Description: Gender Jack, Current Rating 5A, Pin Diameter 2.5mm, Connector Mounting Through Hole Mount, Contact Termination Type Solder, Barrel O.D. 6.3mm; Contact Termination Type: Solder; Connector Mounting: PCB; Current Rating: 5; Gender: Receptacle; Voltage Rating V AC: 250; Supplier 1: Farnell; Supplier Part Number 1: 1608726; Mounting Type: PCB Through Hole; Contact Termination: Solder
J18 = Jumper: Manufacturer Part Number 1: 961102-6404-AR; Part Description: 2 Positions Header, Unshrouded Connector 0.100" (2.54mm) Through Hole Gold; Manufacturer: 3M; Connector Type: Header, Unshrouded; Supplier 1: Digi-Key; Supplier Part Number 1: 3M9447-ND; Contact Type: Male Pin; Color: Black; Mounting Type: Through Hole; Category: Connectors, Interconnects; Contact Finish: Gold
L1 = Inductor_0603: Manufacturer Part Number 1: IHLP4040DZER2R2M01; Manufacturer: Vishay Dale; Part Description: FIXED IND 2.2UH 12A 9 MOHM SMD; Inductance: 2.2µH; Type: Molded; Current Rating: 12A; Frequency - Test: 100kHz; Current - Saturation: 25.6A; DC Resistance (DCR): 9 mOhm Max; Shielding: Shielded; Tolerance: ±20%; Supplier 1: Digi-Key; Supplier Part Number 1: 541-1299-1-ND; Package / Case: Nonstandard; Material - Core: -; Size / Dimension: 0.430" L x 0.405" W (10.92mm x 10.30mm); Supplier Device Package: -; Frequency - Self Resonant: -; Packaging: Cut Tape (CT); Height - Seated (Max): 0.158" (4.00mm); Category: Inductors, Coils, Chokes; RoHS: RoHS Compliant; Mounting Type: Surface Mount; Operating Temperature: -55°C ~ 125°C; Q @ Freq: -; value: 2.2uH
L2 = Inductor_0603: Manufacturer: Vishay Dale; Manufacturer Part Number 1: IHLP3232DZER1R0M01; Part Description: FIXED IND 1UH 18A 5.78 MOHM SMD; Tolerance: ±20%; Frequency - Test: 100kHz; DC Resistance (DCR): 5.78 mOhm Max; Inductance: 1µH; Frequency - Self Resonant: 42MHz; Shielding: Shielded; Current - Saturation: 24A; Current Rating: 18A; Type: Molded; value: 1uH; Supplier 1: Digi-Key; Supplier Part Number 1: 541-1371-6-ND; Supplier Device Package: -; Packaging: Digi-Reel®; Height - Seated (Max): 0.158" (4.00mm); RoHS: RoHS Compliant; Size / Dimension: 0.340" L x 0.322" W (8.64mm x 8.18mm); Category: Inductors, Coils, Chokes; Mounting Type: Surface Mount; Material - Core: -; Package / Case: Nonstandard; Q @ Freq: -; Operating Temperature: -55°C ~ 125°C
LED9 = LED_green: Part Description: LED GREEN DIFFUSED 0603 SMD; Manufacturer: Broadcom Limited; Current - Test: 20mA; Voltage - Forward (Vf) (Typ): 2.2V; Color: Green; Supplier 1: Digi-Key; Supplier Part Number 1: 516-1425-2-ND; Category: Optoelectronics; Package / Case: 0603 (1608 Metric)
MECH11-MECH14 = STANDOFF_M-F_THREADED_M3x8x10mm_HEX_5mm dia: STANDOFF M/F MET 5MM HEX 10MM L; Manufacturer 1: Keystone Electronics; Manufacturer Part Number 1: 24313; Part Description: HEX STANDOFF M3 BRASS 10MM; Thread/Screw/Hole Size: M3 Thread; Plating: Nickel; Between Board Height: 0.394" (10.0mm); SCDType: undef; RoHS: RoHS Compliant; Description 1: STANDOFF M/F MET 5MM HEX 10MM L; Category: Hardware Fasteners Accessories; Stock 1: 240; Pricing 1: 10=0.969, 100=0.881, 500=0.58, 1000=0.3685, 2500=0.34215 (USD); Type: Hex Threaded, Male/Female; Size: 0.197" (5.0mm) Hex; Length - Overall: 0.709" (18.0mm); Material: Brass; Color: Natural; ComponentLink1URL: http://www.keyelco.com/pdfs/M55p67.pdf; ComponentLink1Description: http://www.keyelco.com/pdfs/M55p67.pdf; Supplier 1: Digi-Key; Supplier Part Number 1: 24313K-ND; Manufacturer: Keystone Electronics
R136 R139 R140 R144 R153 R157 R158 R168 R169 R177 = Res_0402: as R106-R108 on sheet 14_Clocks_1; Value: 0R; Supplier 1: Digi-Key; Supplier Part Number 1: 311-0.0JRTR-ND; Category: Resistors; Temperature Coefficient: -; Features: Moisture Resistant; Supplier Device Package: 0402; Height: 0.016" (0.40mm); Package / Case: 0402 (1005 Metric); Operating Temperature: -55°C ~ 155°C; Size / Dimension: 0.039" L x 0.020" W (1.00mm x 0.50mm); Composition: Thick Film; Packaging: Tape & Reel (TR); Number of Terminations: 2; RoHS: RoHS Compliant
R137 R138 = Res_0402: Manufacturer Part Number 1: CRCW08050000Z0EA; Manufacturer: Vishay Dale; Part Description: RES SMD 0.0 OHM JUMPER 1/8W 0805; Power (Watts): 0.125W, 1/8W; Resistance (Ohms): 0.0; Tolerance: Jumper; Value: 0R; Supplier 1: Digi-Key; Supplier Part Number 1: 541-0.0ATR-ND; Package / Case: 0805 (2012 Metric); Height: 0.020" (0.50mm); Packaging: Tape & Reel (TR); Operating Temperature: -55°C ~ 155°C; Temperature Coefficient: -; RoHS: RoHS Compliant; Size / Dimension: 0.079" L x 0.049" W (2.00mm x 1.25mm); Supplier Device Package: 0805 (2012 Metric); Number of Terminations: 2; Category: Resistors; Features: Automotive AEC-Q200; Composition: Thick Film
R141 R145 R156 R159 R165 R171 = Res_0402: Manufacturer: Stackpole Electronics Inc; Manufacturer Part Number 1: RMCF0402FT1K00; Part Description: RES SMD 1K OHM 1% 1/16W 0402; Temperature Coefficient: ±100ppm/°C; Power (Watts): 0.063W, 1/16W; Value: 1k, 1%; Supplier 1: Digi-Key; Supplier Part Number 1: RMCF0402FT1K00TR-ND; Resistance (Ohms): 1k; Packaging: Tape & Reel (TR); Category: Resistors; RoHS: RoHS Compliant; Tolerance: ±1%; Height: 0.016" (0.40mm); Number of Terminations: 2; Package / Case: 0402 (1005 Metric); Operating Temperature: -55°C ~ 155°C; Features: -; Composition: Thick Film; Supplier Device Package: 0402; Size / Dimension: 0.039" L x 0.020" W (1.00mm x 0.50mm)
R142 = Res_0402: Manufacturer: Panasonic Electronic Components; Manufacturer Part Number 1: ERA-2AED471X; Part Description: RES SMD 470 OHM 0.5% 1/16W 0402; Power (Watts): 0.063W, 1/16W; Temperature Coefficient: ±25ppm/°C; Resistance (Ohms): 470; Value: 470R, 0.5%; Supplier 1: Digi-Key; Supplier Part Number 1: P470DETR-ND; Tolerance: ±0.5%; Packaging: Tape & Reel (TR); Number of Terminations: 2; Operating Temperature: -55°C ~ 155°C; RoHS: RoHS Compliant; Size / Dimension: 0.039" L x 0.020" W (1.00mm x 0.50mm); Composition: Thin Film; Package / Case: 0402 (1005 Metric); Height: 0.016" (0.40mm); Features: Automotive AEC-Q200; Supplier Device Package: 0402; Category: Resistors
R143 = Res_0402: Part Description: RES SMD 470 OHM 0.5% 1/16W 0402; Temperature Coefficient: ±25ppm/°C; Supplier 1: Digi-Key; Supplier Part Number 1: P470DETR-ND; Category: Resistors; Number of Terminations: 2; Composition: Thin Film; Tolerance: ±0.5%; value: 470R, 0.5%
R146 R164 R173 = Res_0402: Manufacturer Part Number 1: RMCF0402FT806R; Manufacturer: Stackpole Electronics Inc; Part Description: RMCF0402FT806RCT-ND; Resistance (Ohms): 806; Power (Watts): 0.063W, 1/16W; Temperature Coefficient: ±100ppm/°C; Value: 806R, 1%; Supplier 1: Digi-Key; Supplier Part Number 1: RMCF0402FT806RCT-ND; Category: Resistors; Size / Dimension: 0.039" L x 0.020" W (1.00mm x 0.50mm); Tolerance: ±1%; Features: -; Number of Terminations: 2; RoHS: RoHS Compliant; Operating Temperature: -55°C ~ 155°C; Packaging: Cut Tape (CT); Package / Case: 0402 (1005 Metric); Composition: Thick Film; Height: 0.016" (0.40mm); Supplier Device Package: 0402
R147 R152 R154 R161 R166 R170 R172 R176 = Res_0402: Manufacturer: Yageo; Manufacturer Part Number 1: RC0402FR-0710KL; Part Description: RES SMD 10K OHM 1% 1/16W 0402; Temperature Coefficient: ±100ppm/°C; Power (Watts): 0.063W, 1/16W; Value: 10k, 1%; Supplier 1: Digi-Key; Supplier Part Number 1: 311-10.0KLRTR-ND; Resistance (Ohms): 10k; Packaging: Tape & Reel (TR); RoHS: RoHS Compliant; Package / Case: 0402 (1005 Metric); Tolerance: ±1%; Operating Temperature: -55°C ~ 155°C; Size / Dimension: 0.039" L x 0.020" W (1.00mm x 0.50mm); Number of Terminations: 2; Category: Resistors; Height: 0.016" (0.40mm); Supplier Device Package: 0402; Features: Moisture Resistant; Composition: Thick Film
R148 R151 R162 = Res_0402: Manufacturer Part Number 1: ERJ-2RKF4422X; Manufacturer: Panasonic Electronic Components; Part Description: RES SMD 44.2K OHM 1% 1/10W 0402; Power (Watts): 0.1W, 1/10W; Temperature Coefficient: ±100ppm/°C; Value: 44.2k, 1%; Supplier 1: Digi-Key; Supplier Part Number 1: P44.2KLCT-ND; Tolerance: ±1%; Supplier Device Package: 0402; Packaging: Cut Tape (CT); Size / Dimension: 0.039" L x 0.020" W (1.00mm x 0.50mm); Features: Automotive AEC-Q200; Package / Case: 0402 (1005 Metric); Height: 0.016" (0.40mm); Operating Temperature: -55°C ~ 155°C; Number of Terminations: 2; Composition: Thick Film; Resistance (Ohms): 44.2k; RoHS: RoHS Compliant; Category: Resistors
R149 = Res_0402: Manufacturer: Panasonic Electronic Components; Manufacturer Part Number: ERJ-2GEJ104X; Part Description: RES SMD 100K OHM 5% 1/10W 0402; Power (Watts): 0.1W, 1/10W; Temperature Coefficient: ±200ppm/°C; Value: 100k, 5%; Supplier 1: Digi-Key; Supplier Part Number 1: P100KJTR-ND; Category: Resistors; Size / Dimension: 0.039" L x 0.020" W (1.00mm x 0.50mm); Supplier Device Package: 0402; Composition: Thick Film; Number of Terminations: 2; RoHS: RoHS Compliant; Height: 0.016" (0.40mm); Operating Temperature: -55°C ~ 155°C; Features: Automotive AEC-Q200; Tolerance: ±5%; Packaging: Tape & Reel (TR); Resistance (Ohms): 100k; Package / Case: 0402 (1005 Metric)
R150 = Res_0402: Manufacturer: Stackpole Electronics Inc.; Manufacturer Part Number 1: RMCF0402FT2K21; Part Description: RES SMD 2.21K OHM 1% 1/16W 0402; Power (Watts): 0.063W, 1/16W; Temperature Coefficient: ±100ppm/°C; Value: 2.21k, 1%; Supplier 1: Digi-Key; Supplier Part Number 1: RMCF0402FT2K21CT-ND; Operating Temperature: -55°C ~ 155°C; Height: 0.016" (0.40mm); Tolerance: ±1%; Resistance (Ohms): 2.21k; Features: Automotive AEC-Q200; Package / Case: 0402 (1005 Metric); Packaging: Cut Tape (CT); Composition: Thick Film; Category: Resistors; Supplier Device Package: 0402; Number of Terminations: 2; RoHS: RoHS Compliant; Size / Dimension: 0.039" L x 0.020" W (1.00mm x 0.50mm)
R155 = Res_0402: Manufacturer Part Number: RC0402FR-07750RL; Manufacturer: Yageo; Part Description: RES SMD 750 OHM 1% 1/16W 0402; Resistance (Ohms): 750; Power (Watts): 0.063W, 1/16W; Temperature Coefficient: ±100ppm/°C; Value: 750R, 1%; Tolerance: ±1%; Number of Terminations: 2; Supplier Device Package: 0402; Size / Dimension: 0.039" L x 0.020" W (1.00mm x 0.50mm); Height: 0.016" (0.40mm); Composition: Thick Film; Features: Moisture Resistant; Operating Temperature: -55°C ~ 155°C; Package / Case: 0402 (1005 Metric); Supplier 1: Digi-Key; RoHS: RoHS Compliant; Category: Resistors; Packaging: Cut Tape (CT); Supplier Part Number 1: 311-750LRCT-ND
R160 = Res_0402: Manufacturer Part Number: CRCW0402560RFKED; Manufacturer: Vishay Dale; Part Description: RES SMD 560 OHM 1% 1/16W 0402; Resistance (Ohms): 560; Power (Watts): 0.063W, 1/16W; Temperature Coefficient: ±100ppm/°C; RoHS: RoHS Compliant; Packaging: Cut Tape (CT); Composition: Thick Film; Tolerance: ±1%; Number of Terminations: 2; Supplier Device Package: 0402 (1005 Metric); Operating Temperature: -55°C ~ 155°C; Features: Automotive AEC-Q200; Category: Resistors; Supplier Part Number 1: 541-560LCT-ND; Package / Case: 0402 (1005 Metric); Supplier 1: Digi-Key; Height: 0.016" (0.40mm); Size / Dimension: 0.039" L x 0.020" W (1.00mm x 0.50mm)
R163 = Res_0402: Manufacturer: Panasonic Electronic Components; Manufacturer Part Number 1: ERJ-2RKF1243X; Part Description: RES SMD 124K OHM 1% 1/10W 0402; Power (Watts): 0.1W, 1/10W; Temperature Coefficient: ±100ppm/°C; Value: 124k, 1%; Supplier 1: Digi-Key; Supplier Part Number 1: P124KLCT-ND; Category: Resistors; Package / Case: 0402 (1005 Metric); Operating Temperature: -55°C ~ 155°C; Tolerance: ±1%; Packaging: Cut Tape (CT); Resistance (Ohms): 124k; Features: Automotive AEC-Q200; Height: 0.016" (0.40mm); Number of Terminations: 2; Supplier Device Package: 0402; Size / Dimension: 0.039" L x 0.020" W (1.00mm x 0.50mm); RoHS: RoHS Compliant; Composition: Thick Film
R167 = Res_0402: Manufacturer Part Number 1: ERJ-2RKF6652X; Manufacturer: Panasonic Electronic Components; Part Description: RES SMD 66.5K OHM 1% 1/10W 0402; Temperature Coefficient: ±100ppm/°C; Power (Watts): 0.1W, 1/10W; Value: 66.5k, 1%; Supplier 1: Digi-Key; Supplier Part Number 1: P66.5KLDKR-ND; Packaging: Digi-Reel®; Operating Temperature: -55°C ~ 155°C; Height: 0.016" (0.40mm); Size / Dimension: 0.039" L x 0.020" W (1.00mm x 0.50mm); Number of Terminations: 2; Package / Case: 0402 (1005 Metric); Resistance (Ohms): 66.5k; Category: Resistors; Supplier Device Package: 0402; Features: Automotive AEC-Q200; Composition: Thick Film; RoHS: RoHS Compliant; Tolerance: ±1%
R174 = Res_0402: Part Description: RES SMD 39K OHM 1% 1/16W 0402; Manufacturer Part Number 1: RC0402FR-0739KL; Manufacturer: Yageo; Power (Watts): 0.063W, 1/16W; Temperature Coefficient: ±100ppm/°C; Value: 39k, 1%; Supplier 1: Digi-Key; Supplier Part Number 1: 311-39.0KLRCT-ND; Operating Temperature: -55°C ~ 155°C; Height: 0.016" (0.40mm); Supplier Device Package: 0402; Composition: Thick Film; RoHS: RoHS Compliant; Number of Terminations: 2; Part Status: Active; Category: Resistors; Tolerance: ±1%; Resistance (Ohms): 39k; Package / Case: 0402 (1005 Metric); Features: Moisture Resistant; Size / Dimension: 0.039" L x 0.020" W (1.00mm x 0.50mm); Packaging: Cut Tape (CT)
R175 = Res_0402: Part Description: RES SMD 23.2K OHM 1% 1/16W 0402; Manufacturer: Yageo; Manufacturer Part Number 1: RC0402FR-0723K2L; Power (Watts): 0.063W, 1/16W; Temperature Coefficient: ±100ppm/°C; Value: 23.2k, 1%; Supplier 1: Digi-Key; Supplier Part Number 1: YAG3066CT-ND; Part Status: Active; Operating Temperature: -55°C ~ 155°C; Package / Case: 0402 (1005 Metric); Packaging: Cut Tape (CT); Number of Terminations: 2; Height: 0.016" (0.40mm); Tolerance: ±1%; Composition: Thick Film; Supplier Device Package: 0402; Size / Dimension: 0.039" L x 0.020" W (1.00mm x 0.50mm); Resistance (Ohms): 23.2k; Category: Resistors; Features: Moisture Resistant; RoHS: RoHS Compliant
TP1 TP2 = TESTPOINT_THT_MINI: Test Point PCB mount Miniature White; Manufacturer: Keystone Electronics; Manufacturer Part Number 1: 5011; Part Description: TEST POINT PC MULTI PURPOSE BLK; Supplier 1: Digi-Key; Supplier Part Number 1: 5011K-ND; Category: Test and Measurement; Mounting Type: 0.063" (1.60mm) Hole Diameter; Material: Base, Nylon 46, UL 94V-0; Color: Black; Terminal: 0.015" x 0.032" (0.38mm x 0.81mm) Phosphor Bronze Wire, Silver Plated; Type: PC Test Point, Multipurpose; Packaging: Bulk; RoHS: RoHS Compliant
VD1 = MMBD1205: Part Description: DIODE ARRAY GP 100V 200MA SOT23; Manufacturer: FAIRCHILD SEMICONDUCTOR; Reverse Recovery Time (trr): 4ns; Diode Configuration: 1 Pair Common Anode; Voltage - DC Reverse (Vr) (Max): 100V; Current - Average Rectified (Io) (per Diode): 200mA; Current - Reverse Leakage @ Vr: 50nA @ 50V; Voltage - Forward (Vf) (Max) @ If: 1V @ 200mA; Supplier 1: Digi-Key; Category: Discrete Semiconductor Products; Supplier Device Package: SOT-23-3 (TO-236); Package / Case: TO-236-3, SC-59, SOT-23-3; Supplier Part Number 1: MMBD1205CT-ND
VT6 VT7 = BSC093N04LS_G: Manufacturer: Infineon Technologies; Part Description: MOSFET N-CH 40V 49A TDSON-8; Power - Max: 35W; Vgs(th) (Max) @ Id: 2V @ 14µA; Current - Continuous Drain (Id) @ 25°C: 13A (Ta), 49A (Tc); FET Type: MOSFET N-Channel, Metal Oxide; Rds On (Max) @ Id, Vgs: 9.3 mOhm @ 40A, 10V; Gate Charge (Qg) @ Vgs: 24nC @ 10V; Input Capacitance (Ciss) @ Vds: 1900pF @ 20V; Drain to Source Voltage (Vdss): 40V; Supplier 1: Digi-Key; Category: Discrete Semiconductor Products; Manufacturer Part Number 1: BSC093N04LS G; Package / Case: 8-PowerTDFN; Supplier Part Number 1: BSC093N04LS GDKR-ND